# Altium schematic sheet CVC_power.SchDoc
size 296 x 209 mm
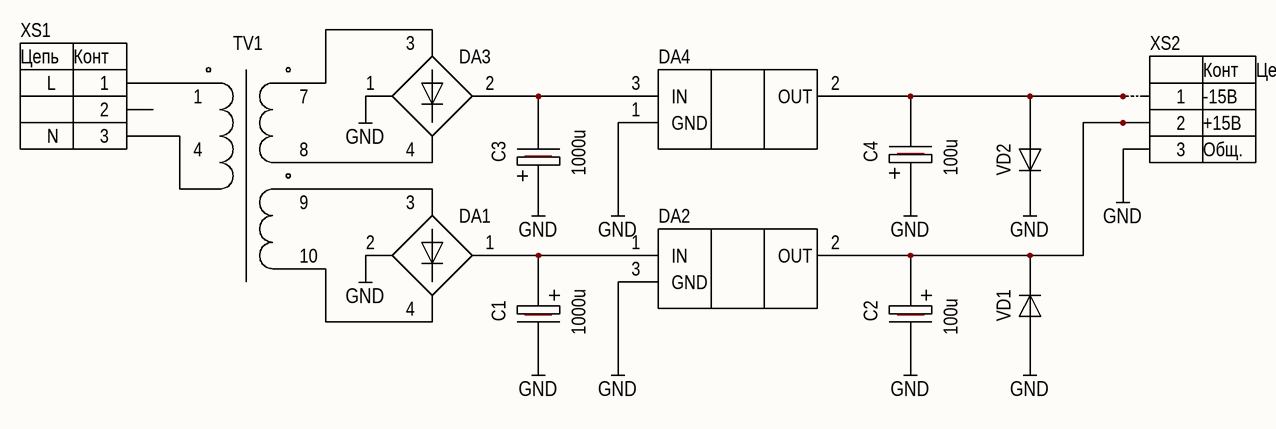
[diagram p0: CVC_power.SchDoc]

## Parts
C1  label: 1000u  [CAPPR5-13x20]  (hidden comment: Конденсатор К50-68)
C2  label: 100u  [CAPPR5-13x20]  (hidden comment: Конденсатор К50-68)
C3  label: 1000u  [CAPPR5-13x20]  (hidden comment: Конденсатор К50-68)
C4  label: 100u  [CAPPR5-13x20]  (hidden comment: Конденсатор К50-68)
DA1  диодный мост  [DF08M]  (value not drawn)
DA2  L7815ACV  [TO220ABN]  (value not drawn)
DA3  диодный мост  [DF08M]  (value not drawn)
DA4  L7915ACV  [TO220V]  (value not drawn)
TV1  Трансформатор ТП 112/ТПК-2  [Transformer TP 112/TPK - 2]  (value not drawn)
VD1  1N4001  [DO-41]  (value not drawn)
VD2  1N4001  [DO-41]  (value not drawn)
XS1  Клемма 15EDGRC-3.81-03P (XY2500R)  [15EDGRC-3.81-03P]  (value not drawn)
XS2  Клемма 15EDGRC-3.81-03P (XY2500R)  [15EDGRC-3.81-03P]  (value not drawn)

## Nets
+15V: C2.1(+) DA2.2(OUT) VD1.2(K) XS2.2
-15V: C4.2(-) DA4.2(OUT) VD2.1(A) XS2.1
GND: C1.2(-) C2.2(-) C3.1(+) C4.1(+) DA1.2(-) DA2.3(GND) DA3.1(+) DA4.1(GND) VD1.1(A) VD2.2(K) XS2.3
NetC1_1: C1.1(+) DA1.1(+) DA2.1(IN)
NetC3_2: C3.2(-) DA3.2(-) DA4.3(IN)
NetDA1_3: DA1.3 TV1.9(S9)
NetDA1_4: DA1.4 TV1.10(S10)
NetDA3_3: DA3.3 TV1.7(S7)
NetDA3_4: DA3.4 TV1.8(S8)
NetTV1_1: TV1.1(P1) XS1.1
NetTV1_4: TV1.4(P4) XS1.3

Not connected (* = marked no-connect by the designer): TV1 2 3 5 6; XS1 2

## Notes on the sheet
- L
- (near DA3) 1
- (near DA3) 3
- (near DA3) 2
- N
- (near DA3) 4
- (near XS2) -15В
- (near XS2) +15B
- (near XS2) Общ.
- (near DA1) 3
- (near DA1) 2
- (near DA1) 1
- (near DA1) 4
- Инв. № подл.
- Подп. и дата
- Взам. инв. №
- Инв. № дубл.
- Справ. №
- Перв. примен.
- ИГУ.000000.002 Э3
- Изм.
- Лист
- № докум.
- Подп.
- Дата
- Блок питания
- Лит.
- Масса
- Масштаб
- Разраб.
- Пров.
- Т.контр.
- Лисун И.В.
- Скудаев Ю.Д.
- принципиальная
- Схема электрическая
- Листов
- Н.контр.
- ИГУ
- Утв.
- Дроков В.Г.
- Копировал:
- Формат А4
- (in symbol Клемма 15EDGRC-3.81-03P (XY2500R)) Конт; Цепь

## Library data of the parts
C1 C3 = Конденсатор К50-68: Электролитический конденсатор; dopusk: +80-20%; type: конденсаторы; codegr: 1002060109; value: 1000 мкФ; napr: 35 В; name: К50-68; enter: *
C2 C4 = Конденсатор К50-68: Электролитический конденсатор; dopusk: +80-20%; type: конденсаторы; codegr: 1002060109; value: 100 мкФ; napr: 25 В; name: К50-68; enter: *
DA1 DA3 = Мост DB08M: type: микросхемы аналоговые; name: DF08M
TV1 = Трансформатор ТП 112/ТПК-2: name: ТП 112 - 10/ТПК-2; type: Трансформаторы
VD1 VD2 = 1N4001: type: диоды; name: 1N4001
DA2 = L7815ACV: type: микросхемы аналоговые; name: 7815ACV
DA4 = L7915ACV: type: микросхемы аналоговые; name: L7915ACV
XS1 XS2 = Клемма 15EDGRC-3.81-03P (XY2500R): name: Клемма 15EDGRC-3.81-03P; type: коннекторы